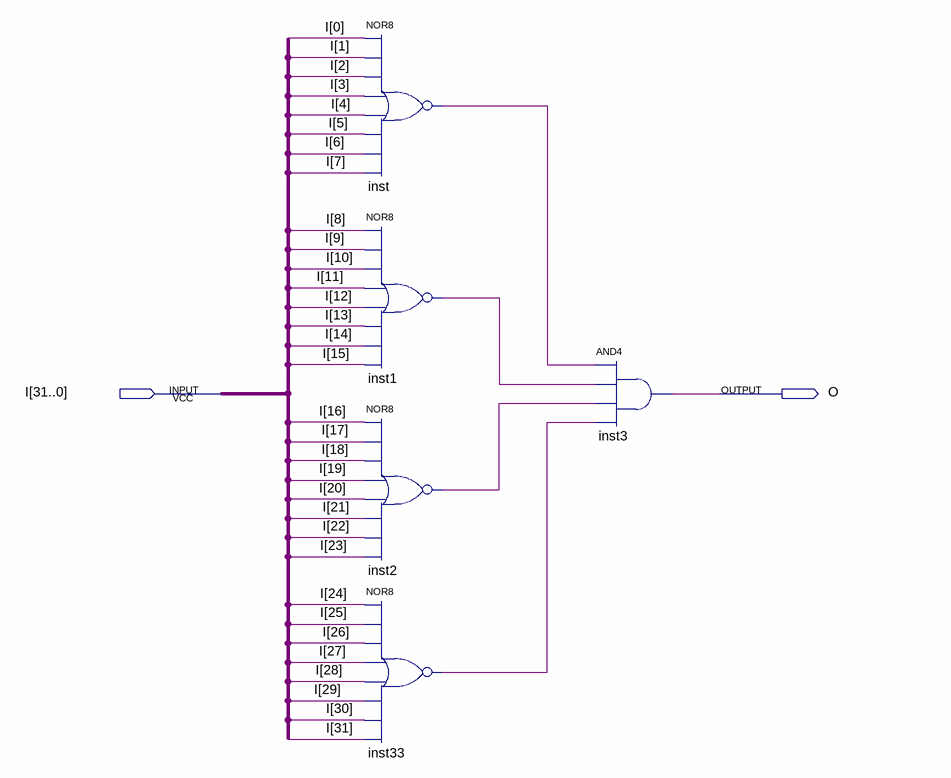
[diagram p0: schematic sheet]
// Quartus schematic nor32.bdf as structural Verilog: 5 symbols, 2 pins
module nor32 (
  input  [31:0] I,
  output O
);

  wire inst1_out, inst2_out, inst33_out, inst_out;

  nor inst (inst_out, I[0], I[1], I[2], I[3], I[4], I[5], I[6], I[7]);
  nor inst1 (inst1_out, I[8], I[9], I[10], I[11], I[12], I[13], I[14], I[15]);
  nor inst2 (inst2_out, I[16], I[17], I[18], I[19], I[20], I[21], I[22], I[23]);
  nor inst33 (inst33_out, I[24], I[25], I[26], I[27], I[28], I[29], I[30], I[31]);
  and inst3 (O, inst_out, inst1_out, inst2_out, inst33_out);
endmodule
